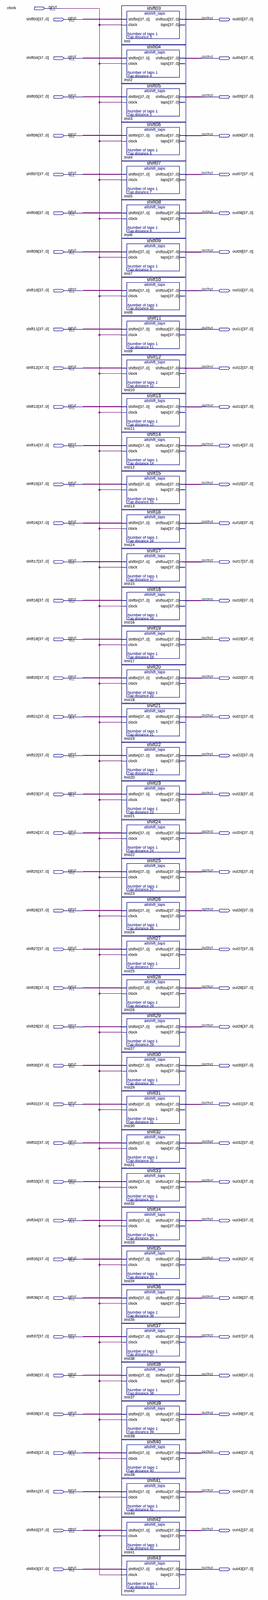
[diagram p0: schematic sheet, whole]
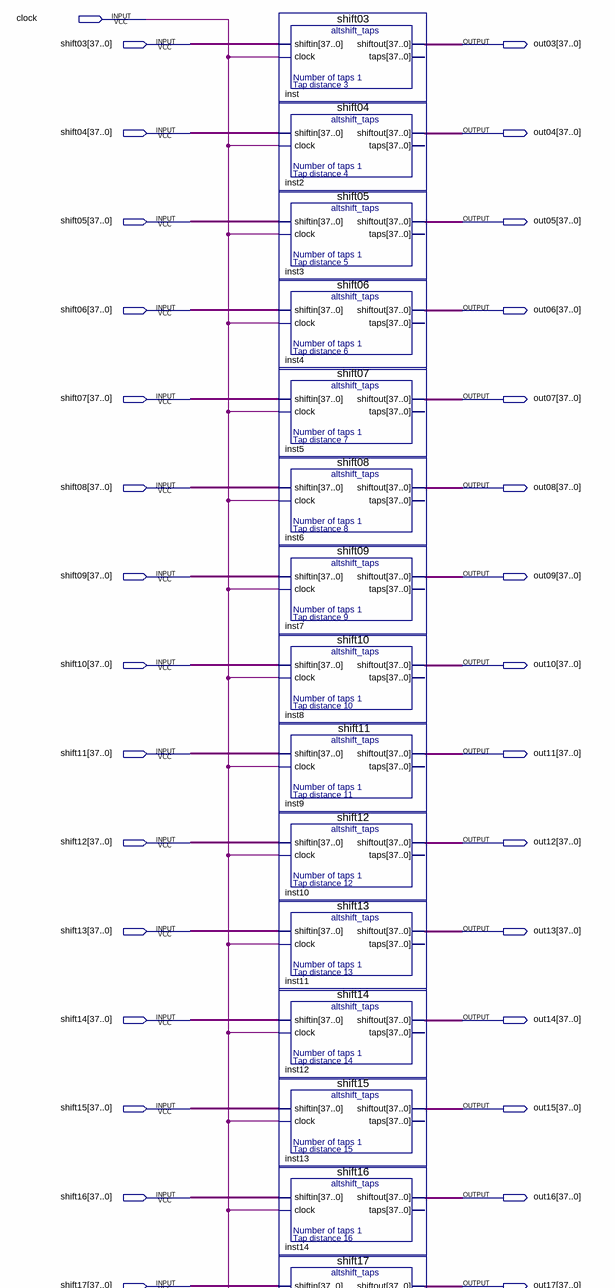
[diagram p1: schematic sheet, upper part]
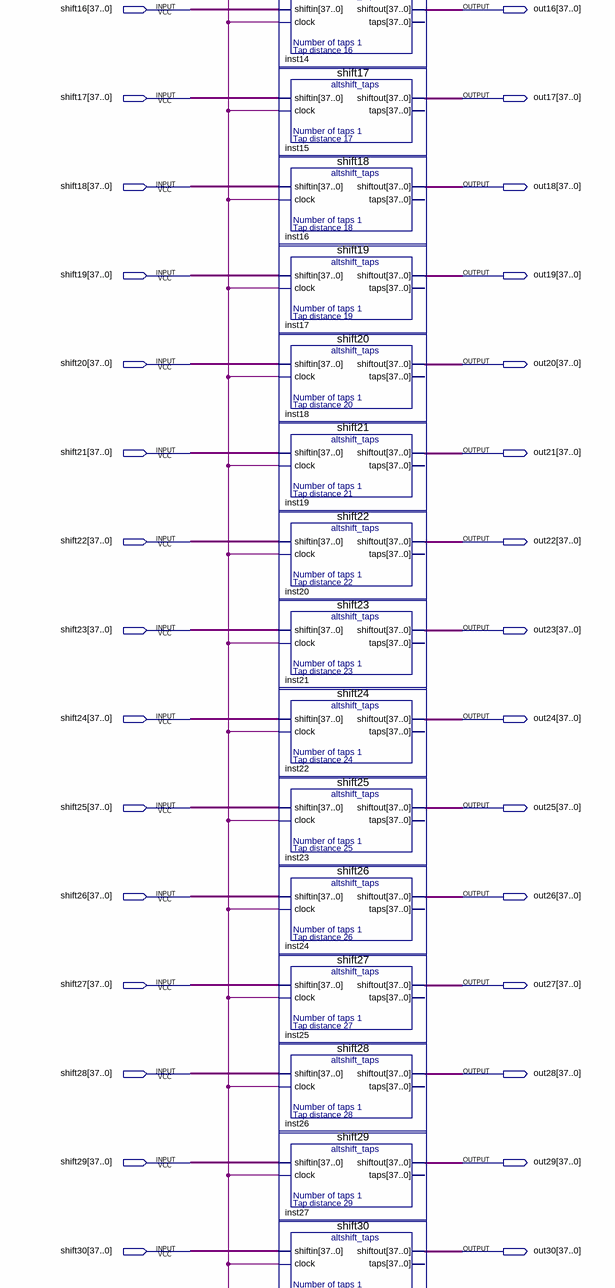
[diagram p2: schematic sheet, middle part]
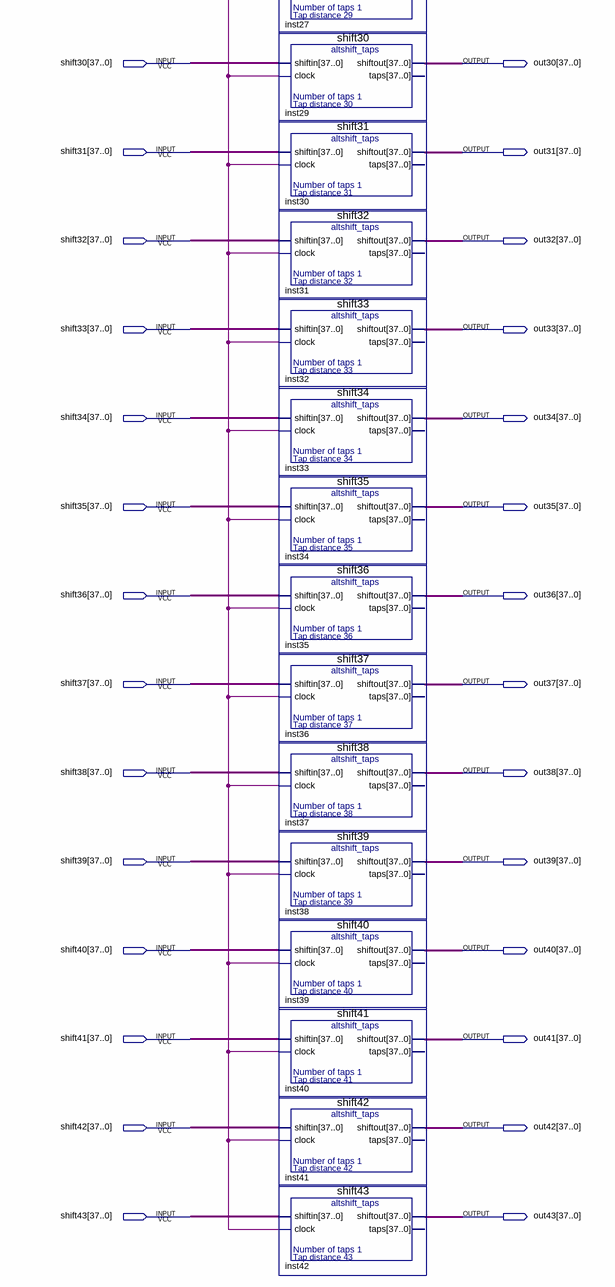
[diagram p3: schematic sheet, lower part]
// Quartus schematic array_serial2.bdf as structural Verilog: 41 symbols, 83 pins
module array_serial2 (
  input  clock,
  input  [37:0] shift03,
  input  [37:0] shift04,
  input  [37:0] shift05,
  input  [37:0] shift06,
  input  [37:0] shift07,
  input  [37:0] shift08,
  input  [37:0] shift09,
  input  [37:0] shift10,
  input  [37:0] shift11,
  input  [37:0] shift12,
  input  [37:0] shift13,
  input  [37:0] shift14,
  input  [37:0] shift15,
  input  [37:0] shift16,
  input  [37:0] shift17,
  input  [37:0] shift18,
  input  [37:0] shift19,
  input  [37:0] shift20,
  input  [37:0] shift21,
  input  [37:0] shift22,
  input  [37:0] shift23,
  input  [37:0] shift24,
  input  [37:0] shift25,
  input  [37:0] shift26,
  input  [37:0] shift27,
  input  [37:0] shift28,
  input  [37:0] shift29,
  input  [37:0] shift30,
  input  [37:0] shift31,
  input  [37:0] shift32,
  input  [37:0] shift33,
  input  [37:0] shift34,
  input  [37:0] shift35,
  input  [37:0] shift36,
  input  [37:0] shift37,
  input  [37:0] shift38,
  input  [37:0] shift39,
  input  [37:0] shift40,
  input  [37:0] shift41,
  input  [37:0] shift42,
  input  [37:0] shift43,
  output [37:0] out03,
  output [37:0] out04,
  output [37:0] out05,
  output [37:0] out06,
  output [37:0] out07,
  output [37:0] out08,
  output [37:0] out09,
  output [37:0] out10,
  output [37:0] out11,
  output [37:0] out12,
  output [37:0] out13,
  output [37:0] out14,
  output [37:0] out15,
  output [37:0] out16,
  output [37:0] out17,
  output [37:0] out18,
  output [37:0] out19,
  output [37:0] out20,
  output [37:0] out21,
  output [37:0] out22,
  output [37:0] out23,
  output [37:0] out24,
  output [37:0] out25,
  output [37:0] out26,
  output [37:0] out27,
  output [37:0] out28,
  output [37:0] out29,
  output [37:0] out30,
  output [37:0] out31,
  output [37:0] out32,
  output [37:0] out33,
  output [37:0] out34,
  output [37:0] out35,
  output [37:0] out36,
  output [37:0] out37,
  output [37:0] out38,
  output [37:0] out39,
  output [37:0] out40,
  output [37:0] out41,
  output [37:0] out42,
  output [37:0] out43
);

  shift03 inst (.shiftin(shift03), .clock(clock), .shiftout(out03));  // open: taps
  shift04 inst2 (.shiftin(shift04), .clock(clock), .shiftout(out04));  // open: taps
  shift05 inst3 (.shiftin(shift05), .clock(clock), .shiftout(out05));  // open: taps
  shift06 inst4 (.shiftin(shift06), .clock(clock), .shiftout(out06));  // open: taps
  shift07 inst5 (.shiftin(shift07), .clock(clock), .shiftout(out07));  // open: taps
  shift08 inst6 (.shiftin(shift08), .clock(clock), .shiftout(out08));  // open: taps
  shift09 inst7 (.shiftin(shift09), .clock(clock), .shiftout(out09));  // open: taps
  shift10 inst8 (.shiftin(shift10), .clock(clock), .shiftout(out10));  // open: taps
  shift11 inst9 (.shiftin(shift11), .clock(clock), .shiftout(out11));  // open: taps
  shift12 inst10 (.shiftin(shift12), .clock(clock), .shiftout(out12));  // open: taps
  shift13 inst11 (.shiftin(shift13), .clock(clock), .shiftout(out13));  // open: taps
  shift14 inst12 (.shiftin(shift14), .clock(clock), .shiftout(out14));  // open: taps
  shift15 inst13 (.shiftin(shift15), .clock(clock), .shiftout(out15));  // open: taps
  shift16 inst14 (.shiftin(shift16), .clock(clock), .shiftout(out16));  // open: taps
  shift17 inst15 (.shiftin(shift17), .clock(clock), .shiftout(out17));  // open: taps
  shift18 inst16 (.shiftin(shift18), .clock(clock), .shiftout(out18));  // open: taps
  shift19 inst17 (.shiftin(shift19), .clock(clock), .shiftout(out19));  // open: taps
  shift20 inst18 (.shiftin(shift20), .clock(clock), .shiftout(out20));  // open: taps
  shift21 inst19 (.shiftin(shift21), .clock(clock), .shiftout(out21));  // open: taps
  shift22 inst20 (.shiftin(shift22), .clock(clock), .shiftout(out22));  // open: taps
  shift23 inst21 (.shiftin(shift23), .clock(clock), .shiftout(out23));  // open: taps
  shift24 inst22 (.shiftin(shift24), .clock(clock), .shiftout(out24));  // open: taps
  shift25 inst23 (.shiftin(shift25), .clock(clock), .shiftout(out25));  // open: taps
  shift26 inst24 (.shiftin(shift26), .clock(clock), .shiftout(out26));  // open: taps
  shift27 inst25 (.shiftin(shift27), .clock(clock), .shiftout(out27));  // open: taps
  shift28 inst26 (.shiftin(shift28), .clock(clock), .shiftout(out28));  // open: taps
  shift29 inst27 (.shiftin(shift29), .clock(clock), .shiftout(out29));  // open: taps
  shift30 inst29 (.shiftin(shift30), .clock(clock), .shiftout(out30));  // open: taps
  shift31 inst30 (.shiftin(shift31), .clock(clock), .shiftout(out31));  // open: taps
  shift32 inst31 (.shiftin(shift32), .clock(clock), .shiftout(out32));  // open: taps
  shift33 inst32 (.shiftin(shift33), .clock(clock), .shiftout(out33));  // open: taps
  shift34 inst33 (.shiftin(shift34), .clock(clock), .shiftout(out34));  // open: taps
  shift35 inst34 (.shiftin(shift35), .clock(clock), .shiftout(out35));  // open: taps
  shift36 inst35 (.shiftin(shift36), .clock(clock), .shiftout(out36));  // open: taps
  shift37 inst36 (.shiftin(shift37), .clock(clock), .shiftout(out37));  // open: taps
  shift38 inst37 (.shiftin(shift38), .clock(clock), .shiftout(out38));  // open: taps
  shift39 inst38 (.shiftin(shift39), .clock(clock), .shiftout(out39));  // open: taps
  shift40 inst39 (.shiftin(shift40), .clock(clock), .shiftout(out40));  // open: taps
  shift41 inst40 (.shiftin(shift41), .clock(clock), .shiftout(out41));  // open: taps
  shift42 inst41 (.shiftin(shift42), .clock(clock), .shiftout(out42));  // open: taps
  shift43 inst42 (.shiftin(shift43), .clock(clock), .shiftout(out43));  // open: taps
endmodule
